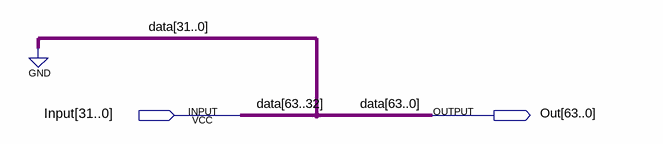
[diagram p0: schematic sheet]
// Quartus schematic ShiftLeft64.bdf as structural Verilog: 0 symbols, 2 pins
module ShiftLeft64 (
  input  [31:0] Input,
  output [63:0] Out
);


  assign Out = {Input, {32{1'b0}}};

  // Other names for the same wires on the sheet: data[63:32] = Input
endmodule
